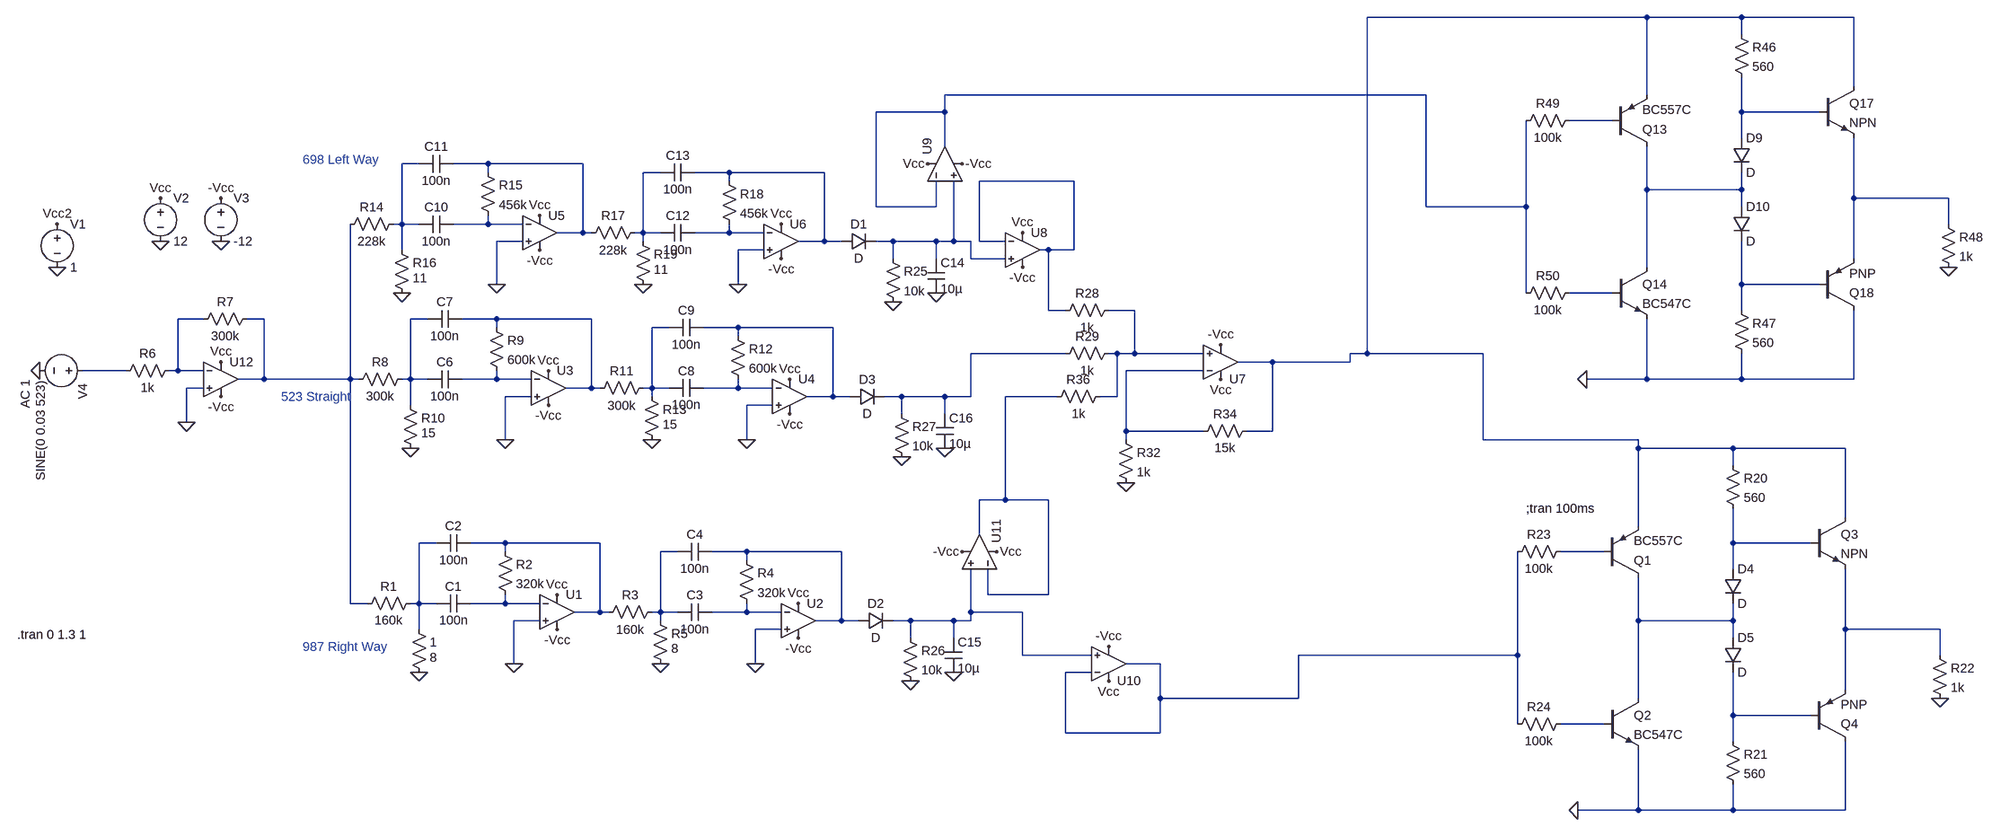
[diagram p0: schematic Might-be-this-one.asc]
Might-be-this-one.asc, the LTspice schematic file:
Version 4
SHEET 1 4472 1424
WIRE 2688 -592 2144 -592
WIRE 2864 -592 2688 -592
WIRE 3072 -592 2864 -592
WIRE 2864 -560 2864 -592
WIRE 3072 -464 3072 -592
WIRE 2256 -448 1360 -448
WIRE 2688 -448 2688 -592
WIRE 1360 -416 1360 -448
WIRE 1360 -416 1232 -416
WIRE 2864 -416 2864 -480
WIRE 3008 -416 2864 -416
WIRE 2624 -400 2544 -400
WIRE 2864 -368 2864 -416
WIRE 1360 -352 1360 -416
WIRE 384 -320 352 -320
WIRE 512 -320 448 -320
WIRE 688 -320 512 -320
WIRE 512 -304 512 -320
WIRE 832 -304 800 -304
WIRE 960 -304 896 -304
WIRE 1136 -304 960 -304
WIRE 960 -288 960 -304
WIRE 1600 -288 1424 -288
WIRE 2688 -272 2688 -352
WIRE 2864 -272 2864 -304
WIRE 2864 -272 2688 -272
WIRE 3072 -256 3072 -368
WIRE 3248 -256 3072 -256
WIRE 800 -240 800 -304
WIRE 1232 -240 1232 -416
WIRE 1344 -240 1344 -288
WIRE 1344 -240 1232 -240
WIRE 2256 -240 2256 -448
WIRE 2464 -240 2464 -400
WIRE 2464 -240 2256 -240
WIRE 2864 -240 2864 -272
WIRE 352 -208 352 -320
WIRE 352 -208 336 -208
WIRE 384 -208 352 -208
WIRE 512 -208 512 -224
WIRE 512 -208 448 -208
WIRE 576 -208 512 -208
WIRE 3248 -208 3248 -256
WIRE 688 -192 688 -320
WIRE 688 -192 640 -192
WIRE 704 -192 688 -192
WIRE 800 -192 800 -240
WIRE 800 -192 784 -192
WIRE 832 -192 800 -192
WIRE 960 -192 960 -208
WIRE 960 -192 896 -192
WIRE 1024 -192 960 -192
WIRE 576 -176 528 -176
WIRE 800 -176 800 -192
WIRE 1136 -176 1136 -304
WIRE 1136 -176 1088 -176
WIRE 1168 -176 1136 -176
WIRE 1264 -176 1232 -176
WIRE 1344 -176 1264 -176
WIRE 1376 -176 1376 -288
WIRE 1376 -176 1344 -176
WIRE 1408 -176 1376 -176
WIRE 1424 -176 1424 -288
WIRE 1472 -176 1424 -176
WIRE 352 -160 352 -208
WIRE 1024 -160 976 -160
WIRE 1552 -160 1536 -160
WIRE 1600 -160 1600 -288
WIRE 1600 -160 1552 -160
WIRE 1264 -144 1264 -176
WIRE 1344 -144 1344 -176
WIRE 1408 -144 1408 -176
WIRE 1472 -144 1408 -144
WIRE 3072 -144 3072 -256
WIRE 2688 -128 2688 -272
WIRE 528 -96 528 -176
WIRE 976 -96 976 -160
WIRE 2864 -96 2864 -176
WIRE 3008 -96 2864 -96
WIRE 2464 -80 2464 -240
WIRE 2624 -80 2544 -80
WIRE 1552 -48 1552 -160
WIRE 1584 -48 1552 -48
WIRE 1712 -48 1664 -48
WIRE 2864 -48 2864 -96
WIRE -16 -32 -64 -32
WIRE 96 -32 64 -32
WIRE 400 -32 368 -32
WIRE 528 -32 464 -32
WIRE 704 -32 528 -32
WIRE 528 -16 528 -32
WIRE 848 -16 816 -16
WIRE 976 -16 912 -16
WIRE 1152 -16 976 -16
WIRE 976 0 976 -16
WIRE 1584 32 1408 32
WIRE 1680 32 1664 32
WIRE 1712 32 1712 -48
WIRE 1712 32 1680 32
WIRE 1840 32 1712 32
WIRE 2144 32 2144 -592
WIRE 2144 32 2112 32
WIRE 2384 32 2144 32
WIRE 1968 48 1904 48
WIRE 2112 48 2112 32
WIRE 2112 48 1968 48
WIRE -160 64 -240 64
WIRE -64 64 -64 -32
WIRE -64 64 -80 64
WIRE -16 64 -64 64
WIRE 1840 64 1696 64
WIRE 96 80 96 -32
WIRE 96 80 48 80
WIRE 256 80 256 -208
WIRE 256 80 96 80
WIRE 272 80 256 80
WIRE 368 80 368 -32
WIRE 368 80 352 80
WIRE 400 80 368 80
WIRE 528 80 528 64
WIRE 528 80 464 80
WIRE 592 80 528 80
WIRE 2688 80 2688 -32
WIRE 2688 80 2576 80
WIRE 2864 80 2864 32
WIRE 2864 80 2688 80
WIRE 3072 80 3072 -48
WIRE 3072 80 2864 80
WIRE -16 96 -48 96
WIRE 704 96 704 -32
WIRE 704 96 656 96
WIRE 720 96 704 96
WIRE 816 96 816 -16
WIRE 816 96 800 96
WIRE 848 96 816 96
WIRE 976 96 976 80
WIRE 976 96 912 96
WIRE 1040 96 976 96
WIRE 592 112 544 112
WIRE 816 112 816 96
WIRE 1152 112 1152 -16
WIRE 1152 112 1104 112
WIRE 1184 112 1152 112
WIRE 1280 112 1248 112
WIRE 1360 112 1280 112
WIRE 1408 112 1408 32
WIRE 1408 112 1360 112
WIRE 1568 112 1472 112
WIRE 1680 112 1680 32
WIRE 1680 112 1648 112
WIRE 368 128 368 80
WIRE 1040 128 992 128
WIRE 1280 144 1280 112
WIRE 1360 144 1360 112
WIRE -48 160 -48 96
WIRE 1696 176 1696 64
WIRE 1840 176 1696 176
WIRE 1968 176 1968 48
WIRE 1968 176 1920 176
WIRE 544 192 544 112
WIRE 992 192 992 128
WIRE 1696 192 1696 176
WIRE 2384 192 2384 32
WIRE 2672 192 2384 192
WIRE 2672 208 2672 192
WIRE 2848 208 2672 208
WIRE 3056 208 2848 208
WIRE 2848 240 2848 208
WIRE 1472 304 1472 112
WIRE 1472 304 1424 304
WIRE 1552 304 1472 304
WIRE 3056 336 3056 208
WIRE 2672 352 2672 208
WIRE 1424 368 1424 304
WIRE 416 384 384 384
WIRE 544 384 480 384
WIRE 720 384 544 384
WIRE 2848 384 2848 320
WIRE 2992 384 2848 384
WIRE 544 400 544 384
WIRE 864 400 832 400
WIRE 992 400 928 400
WIRE 1168 400 992 400
WIRE 2608 400 2528 400
WIRE 992 416 992 400
WIRE 2848 432 2848 384
WIRE 1440 480 1440 432
WIRE 1552 480 1552 304
WIRE 1552 480 1440 480
WIRE 256 496 256 80
WIRE 288 496 256 496
WIRE 384 496 384 384
WIRE 384 496 368 496
WIRE 416 496 384 496
WIRE 544 496 544 480
WIRE 544 496 480 496
WIRE 608 496 544 496
WIRE 720 512 720 384
WIRE 720 512 672 512
WIRE 736 512 720 512
WIRE 832 512 832 400
WIRE 832 512 816 512
WIRE 864 512 832 512
WIRE 992 512 992 496
WIRE 992 512 928 512
WIRE 1056 512 992 512
WIRE 1408 512 1408 432
WIRE 1504 512 1408 512
WIRE 608 528 560 528
WIRE 832 528 832 512
WIRE 1168 528 1168 400
WIRE 1168 528 1120 528
WIRE 1200 528 1168 528
WIRE 1296 528 1264 528
WIRE 1376 528 1296 528
WIRE 1408 528 1408 512
WIRE 1408 528 1376 528
WIRE 2672 528 2672 448
WIRE 2848 528 2848 496
WIRE 2848 528 2672 528
WIRE 384 544 384 496
WIRE 1056 544 1008 544
WIRE 3056 544 3056 432
WIRE 3232 544 3056 544
WIRE 1296 560 1296 528
WIRE 1376 560 1376 528
WIRE 2848 560 2848 528
WIRE 1504 592 1504 512
WIRE 1632 592 1504 592
WIRE 2448 592 2448 400
WIRE 2448 592 2016 592
WIRE 3232 592 3232 544
WIRE 560 608 560 528
WIRE 1008 608 1008 544
WIRE 1760 608 1696 608
WIRE 1632 624 1584 624
WIRE 3056 656 3056 544
WIRE 1760 672 1760 608
WIRE 2016 672 2016 592
WIRE 2016 672 1760 672
WIRE 2672 672 2672 528
WIRE 2848 704 2848 624
WIRE 2992 704 2848 704
WIRE 2448 720 2448 592
WIRE 2608 720 2528 720
WIRE 1584 736 1584 624
WIRE 1760 736 1760 672
WIRE 1760 736 1584 736
WIRE 2848 752 2848 704
WIRE 2672 880 2672 768
WIRE 2672 880 2560 880
WIRE 2848 880 2848 832
WIRE 2848 880 2672 880
WIRE 3056 880 3056 752
WIRE 3056 880 2848 880
FLAG 384 624 0
FLAG -320 64 0
FLAG 640 544 -Vcc
FLAG 560 608 0
FLAG 832 608 0
FLAG 1088 496 Vcc
FLAG 1088 560 -Vcc
FLAG 1008 608 0
FLAG 368 208 0
FLAG 624 64 Vcc
FLAG 624 128 -Vcc
FLAG 544 192 0
FLAG 816 192 0
FLAG 1072 80 Vcc
FLAG 1072 144 -Vcc
FLAG 992 192 0
FLAG 352 -80 0
FLAG 608 -224 Vcc
FLAG 608 -160 -Vcc
FLAG 528 -96 0
FLAG 800 -96 0
FLAG 1056 -208 Vcc
FLAG 1056 -144 -Vcc
FLAG 976 -96 0
FLAG 1280 224 0
FLAG 1360 208 0
FLAG 1376 624 0
FLAG 1296 640 0
FLAG 1264 -64 0
FLAG 1344 -80 0
FLAG -288 -128 0
FLAG -288 -208 Vcc2
FLAG -48 160 0
FLAG 16 112 -Vcc
FLAG 640 480 Vcc
FLAG 16 48 Vcc
FLAG -96 -256 Vcc
FLAG 16 -256 -Vcc
FLAG -96 -176 0
FLAG 16 -176 0
FLAG 3248 -128 0
FLAG 3232 672 0
FLAG 2576 80 0
FLAG 2560 880 0
FLAG 1872 80 Vcc
FLAG 1872 16 -Vcc
FLAG 1328 -320 Vcc
FLAG 1392 -320 -Vcc
FLAG 1664 640 Vcc
FLAG 1664 576 -Vcc
FLAG 1696 272 0
FLAG 1504 -192 Vcc
FLAG 1504 -128 -Vcc
FLAG 1456 400 Vcc
FLAG 1392 400 -Vcc
DATAFLAG 800 -240 "$-V(Vcc)"
SYMBOL res 384 480 R90
WINDOW 0 0 56 VBottom 2
WINDOW 3 32 56 VTop 2
SYMATTR InstName R1
SYMATTR Value 160k
SYMBOL cap 480 480 R90
WINDOW 0 0 32 VBottom 2
WINDOW 3 32 32 VTop 2
SYMATTR InstName C1
SYMATTR Value 100n
SYMBOL cap 480 368 R90
WINDOW 0 0 32 VBottom 2
WINDOW 3 32 32 VTop 2
SYMATTR InstName C2
SYMATTR Value 100n
SYMBOL res 528 384 R0
SYMATTR InstName R2
SYMATTR Value 320k
SYMBOL Opamps\\UniversalOpamp2 640 512 R0
SYMATTR InstName U1
SYMBOL res 368 528 R0
WINDOW 3 36 68 Left 2
SYMATTR Value 8
SYMATTR InstName 1
SYMBOL res 832 496 R90
WINDOW 0 0 56 VBottom 2
WINDOW 3 33 56 VTop 2
SYMATTR InstName R3
SYMATTR Value 160k
SYMBOL cap 928 496 R90
WINDOW 0 0 32 VBottom 2
WINDOW 3 32 32 VTop 2
SYMATTR InstName C3
SYMATTR Value 100n
SYMBOL cap 928 384 R90
WINDOW 0 0 32 VBottom 2
WINDOW 3 32 32 VTop 2
SYMATTR InstName C4
SYMATTR Value 100n
SYMBOL res 976 400 R0
SYMATTR InstName R4
SYMATTR Value 320k
SYMBOL Opamps\\UniversalOpamp2 1088 528 R0
SYMATTR InstName U2
SYMBOL res 816 512 R0
WINDOW 3 36 68 Left 2
SYMATTR Value 8
SYMATTR InstName R5
SYMBOL voltage -224 64 R90
WINDOW 3 17 94 Left 2
WINDOW 123 17 122 Left 2
WINDOW 39 0 0 Left 2
SYMATTR Value SINE(0 0.03 523)
SYMATTR Value2 AC 1
SYMATTR InstName V4
SYMBOL res 368 64 R90
WINDOW 0 0 56 VBottom 2
WINDOW 3 32 56 VTop 2
SYMATTR InstName R8
SYMATTR Value 300k
SYMBOL cap 464 64 R90
WINDOW 0 0 32 VBottom 2
WINDOW 3 32 32 VTop 2
SYMATTR InstName C6
SYMATTR Value 100n
SYMBOL cap 464 -48 R90
WINDOW 0 0 32 VBottom 2
WINDOW 3 32 32 VTop 2
SYMATTR InstName C7
SYMATTR Value 100n
SYMBOL res 512 -32 R0
SYMATTR InstName R9
SYMATTR Value 600k
SYMBOL Opamps\\UniversalOpamp2 624 96 R0
SYMATTR InstName U3
SYMBOL res 352 112 R0
WINDOW 3 36 68 Left 2
SYMATTR Value 15
SYMATTR InstName R10
SYMBOL res 816 80 R90
WINDOW 0 0 56 VBottom 2
WINDOW 3 33 56 VTop 2
SYMATTR InstName R11
SYMATTR Value 300k
SYMBOL cap 912 80 R90
WINDOW 0 0 32 VBottom 2
WINDOW 3 32 32 VTop 2
SYMATTR InstName C8
SYMATTR Value 100n
SYMBOL cap 912 -32 R90
WINDOW 0 0 32 VBottom 2
WINDOW 3 32 32 VTop 2
SYMATTR InstName C9
SYMATTR Value 100n
SYMBOL res 960 -16 R0
SYMATTR InstName R12
SYMATTR Value 600k
SYMBOL Opamps\\UniversalOpamp2 1072 112 R0
SYMATTR InstName U4
SYMBOL res 800 96 R0
WINDOW 3 36 68 Left 2
SYMATTR Value 15
SYMATTR InstName R13
SYMBOL res 352 -224 R90
WINDOW 0 0 56 VBottom 2
WINDOW 3 32 56 VTop 2
SYMATTR InstName R14
SYMATTR Value 228k
SYMBOL cap 448 -224 R90
WINDOW 0 0 32 VBottom 2
WINDOW 3 32 32 VTop 2
SYMATTR InstName C10
SYMATTR Value 100n
SYMBOL cap 448 -336 R90
WINDOW 0 0 32 VBottom 2
WINDOW 3 32 32 VTop 2
SYMATTR InstName C11
SYMATTR Value 100n
SYMBOL res 496 -320 R0
SYMATTR InstName R15
SYMATTR Value 456k
SYMBOL Opamps\\UniversalOpamp2 608 -192 R0
SYMATTR InstName U5
SYMBOL res 336 -176 R0
WINDOW 3 36 68 Left 2
SYMATTR Value 11
SYMATTR InstName R16
SYMBOL res 800 -208 R90
WINDOW 0 0 56 VBottom 2
WINDOW 3 33 56 VTop 2
SYMATTR InstName R17
SYMATTR Value 228k
SYMBOL cap 896 -208 R90
WINDOW 0 0 32 VBottom 2
WINDOW 3 32 32 VTop 2
SYMATTR InstName C12
SYMATTR Value 100n
SYMBOL cap 896 -320 R90
WINDOW 0 0 32 VBottom 2
WINDOW 3 32 32 VTop 2
SYMATTR InstName C13
SYMATTR Value 100n
SYMBOL res 944 -304 R0
SYMATTR InstName R18
SYMATTR Value 456k
SYMBOL Opamps\\UniversalOpamp2 1056 -176 R0
SYMATTR InstName U6
SYMBOL res 784 -192 R0
WINDOW 3 36 68 Left 2
SYMATTR Value 11
SYMATTR InstName R19
SYMBOL diode 1168 -160 R270
WINDOW 0 32 32 VTop 2
WINDOW 3 0 32 VBottom 2
SYMATTR InstName D1
SYMBOL diode 1200 544 R270
WINDOW 0 32 32 VTop 2
WINDOW 3 0 32 VBottom 2
SYMATTR InstName D2
SYMBOL diode 1184 128 R270
WINDOW 0 32 32 VTop 2
WINDOW 3 0 32 VBottom 2
SYMATTR InstName D3
SYMBOL res 1248 -160 R0
SYMATTR InstName R25
SYMATTR Value 10k
SYMBOL res 1280 544 R0
SYMATTR InstName R26
SYMATTR Value 10k
SYMBOL res 1264 128 R0
SYMATTR InstName R27
SYMATTR Value 10k
SYMBOL cap 1328 -144 R0
SYMATTR InstName C14
SYMATTR Value 10µ
SYMBOL cap 1360 560 R0
SYMATTR InstName C15
SYMATTR Value 10µ
SYMBOL cap 1344 144 R0
SYMATTR InstName C16
SYMATTR Value 10µ
SYMBOL voltage -288 -224 R0
WINDOW 123 0 0 Left 2
WINDOW 39 0 0 Left 2
SYMATTR InstName V1
SYMATTR Value 1
SYMBOL Opamps\\UniversalOpamp2 16 80 R0
SYMATTR InstName U12
SYMBOL res -64 48 R90
WINDOW 0 0 56 VBottom 2
WINDOW 3 32 56 VTop 2
SYMATTR InstName R6
SYMATTR Value 1k
SYMBOL res 80 -48 R90
WINDOW 0 0 56 VBottom 2
WINDOW 3 32 56 VTop 2
SYMATTR InstName R7
SYMATTR Value 300k
SYMBOL voltage -96 -272 R0
WINDOW 123 0 0 Left 2
WINDOW 39 0 0 Left 2
SYMATTR InstName V2
SYMATTR Value 12
SYMBOL voltage 16 -272 R0
WINDOW 123 0 0 Left 2
WINDOW 39 0 0 Left 2
SYMATTR InstName V3
SYMATTR Value -12
SYMBOL pnp 2624 -352 M180
SYMATTR InstName Q13
SYMATTR Value BC557C
SYMBOL npn 2624 -128 R0
SYMATTR InstName Q14
SYMATTR Value BC547C
SYMBOL npn 3008 -464 R0
SYMATTR InstName Q17
SYMBOL pnp 3008 -48 M180
SYMATTR InstName Q18
SYMBOL res 2848 -576 R0
SYMATTR InstName R46
SYMATTR Value 560
SYMBOL res 2848 -64 R0
SYMATTR InstName R47
SYMATTR Value 560
SYMBOL diode 2848 -368 R0
SYMATTR InstName D9
SYMBOL diode 2848 -240 R0
SYMATTR InstName D10
SYMBOL res 3232 -224 R0
SYMATTR InstName R48
SYMATTR Value 1k
SYMBOL res 2560 -416 R90
WINDOW 0 0 56 VBottom 2
WINDOW 3 32 56 VTop 2
SYMATTR InstName R49
SYMATTR Value 100k
SYMBOL res 2560 -96 R90
WINDOW 0 0 56 VBottom 2
WINDOW 3 32 56 VTop 2
SYMATTR InstName R50
SYMATTR Value 100k
SYMBOL pnp 2608 448 M180
SYMATTR InstName Q1
SYMATTR Value BC557C
SYMBOL npn 2608 672 R0
SYMATTR InstName Q2
SYMATTR Value BC547C
SYMBOL npn 2992 336 R0
SYMATTR InstName Q3
SYMBOL pnp 2992 752 M180
SYMATTR InstName Q4
SYMBOL res 2832 224 R0
SYMATTR InstName R20
SYMATTR Value 560
SYMBOL res 2832 736 R0
SYMATTR InstName R21
SYMATTR Value 560
SYMBOL diode 2832 432 R0
SYMATTR InstName D4
SYMBOL diode 2832 560 R0
SYMATTR InstName D5
SYMBOL res 3216 576 R0
SYMATTR InstName R22
SYMATTR Value 1k
SYMBOL res 2544 384 R90
WINDOW 0 0 56 VBottom 2
WINDOW 3 32 56 VTop 2
SYMATTR InstName R23
SYMATTR Value 100k
SYMBOL res 2544 704 R90
WINDOW 0 0 56 VBottom 2
WINDOW 3 32 56 VTop 2
SYMATTR InstName R24
SYMATTR Value 100k
SYMBOL Opamps\\UniversalOpamp2 1872 48 M180
SYMATTR InstName U7
SYMBOL res 1680 -64 R90
WINDOW 0 0 56 VBottom 2
WINDOW 3 32 56 VTop 2
SYMATTR InstName R28
SYMATTR Value 1k
SYMBOL res 1680 16 R90
WINDOW 0 0 56 VBottom 2
WINDOW 3 32 56 VTop 2
SYMATTR InstName R29
SYMATTR Value 1k
SYMBOL Opamps\\UniversalOpamp2 1360 -320 R270
SYMATTR InstName U9
SYMBOL Opamps\\UniversalOpamp2 1664 608 M180
SYMATTR InstName U10
SYMBOL res 1680 176 R0
SYMATTR InstName R32
SYMATTR Value 1k
SYMBOL res 1936 160 R90
WINDOW 0 0 56 VBottom 2
WINDOW 3 32 56 VTop 2
SYMATTR InstName R34
SYMATTR Value 15k
SYMBOL res 1664 96 R90
WINDOW 0 0 56 VBottom 2
WINDOW 3 32 56 VTop 2
SYMATTR InstName R36
SYMATTR Value 1k
SYMBOL Opamps\\UniversalOpamp2 1504 -160 R0
SYMATTR InstName U8
SYMBOL Opamps\\UniversalOpamp2 1424 400 M270
SYMATTR InstName U11
TEXT 168 -328 Left 2 ;698 Left Way
TEXT 128 112 Left 2 ;523 Straight
TEXT 168 576 Left 2 ;987 Right Way
TEXT -362 554 Left 2 !.tran 0 1.3 1
TEXT 2464 320 Left 2 !;tran 100ms

The netlist it stands for:
* Might-be-this-one.asc
R1 N030 N019 160k
C1 N036 N030 100n
C2 N031 N030 100n
R2 N031 N036 320k
XU1 0 N036 Vcc -Vcc N031 level.2 Avol=1Meg GBW=10Meg Slew=10Meg ilimit=25m rail=0 Vos=0 phimargin=45 en=0 enk=0 in=0 ink=0 Rin=500Meg  ; pins IN+ IN- V+ V- OUT
R§1 N030 0 8
R3 N033 N031 160k
C3 N037 N033 100n
C4 N034 N033 100n
R4 N034 N037 320k
XU2 0 N037 Vcc -Vcc N034 level.2 Avol=1Meg GBW=10Meg Slew=10Meg ilimit=25m rail=0 Vos=0 phimargin=45 en=0 enk=0 in=0 ink=0 Rin=500Meg  ; pins IN+ IN- V+ V- OUT
R5 N033 0 8
V4 N025 0 SINE(0 0.03 523) AC 1
R8 N020 N019 300k
C6 N027 N020 100n
C7 N021 N020 100n
R9 N021 N027 600k
XU3 0 N027 Vcc -Vcc N021 level.2 Avol=1Meg GBW=10Meg Slew=10Meg ilimit=25m rail=0 Vos=0 phimargin=45 en=0 enk=0 in=0 ink=0 Rin=500Meg  ; pins IN+ IN- V+ V- OUT
R10 N020 0 15
R11 N022 N021 300k
C8 N028 N022 100n
C9 N023 N022 100n
R12 N023 N028 600k
XU4 0 N028 Vcc -Vcc N023 level.2 Avol=1Meg GBW=10Meg Slew=10Meg ilimit=25m rail=0 Vos=0 phimargin=45 en=0 enk=0 in=0 ink=0 Rin=500Meg  ; pins IN+ IN- V+ V- OUT
R13 N022 0 15
R14 N005 N019 228k
C10 N012 N005 100n
C11 N006 N005 100n
R15 N006 N012 456k
XU5 0 N012 Vcc -Vcc N006 level.2 Avol=1Meg GBW=10Meg Slew=10Meg ilimit=25m rail=0 Vos=0 phimargin=45 en=0 enk=0 in=0 ink=0 Rin=500Meg  ; pins IN+ IN- V+ V- OUT
R16 N005 0 11
R17 N007 N006 228k
C12 N013 N007 100n
C13 N008 N007 100n
R18 N008 N013 456k
XU6 0 N013 Vcc -Vcc N008 level.2 Avol=1Meg GBW=10Meg Slew=10Meg ilimit=25m rail=0 Vos=0 phimargin=45 en=0 enk=0 in=0 ink=0 Rin=500Meg  ; pins IN+ IN- V+ V- OUT
R19 N007 0 11
D1 N008 N014 D
D2 N034 N038 D
D3 N023 N024 D
R25 N014 0 10k
R26 N038 0 10k
R27 N024 0 10k
C14 N014 0 10µ
C15 N038 0 10µ
C16 N024 0 10µ
V1 Vcc2 0 1
XU12 0 N018 Vcc -Vcc N019 level.2 Avol=1Meg GBW=10Meg Slew=10Meg ilimit=25m rail=0 Vos=0 phimargin=45 en=0 enk=0 in=0 ink=0 Rin=500Meg  ; pins IN+ IN- V+ V- OUT
R6 N018 N025 1k
R7 N019 N018 300k
V2 Vcc 0 12
V3 -Vcc 0 -12
Q13 N010 N004 N001 0 BC557C
Q14 N010 N016 0 0 BC547C
Q17 N001 N003 N011 0 NPN
Q18 0 N015 N011 0 PNP
R46 N001 N003 560
R47 N015 0 560
D9 N003 N010 D
D10 N010 N015 D
R48 N011 0 1k
R49 N004 N002 100k
R50 N016 N002 100k
Q1 N039 N035 N001 0 BC557C
Q2 N039 N043 0 0 BC547C
Q3 N001 N032 N040 0 NPN
Q4 0 N042 N040 0 PNP
R20 N001 N032 560
R21 N042 0 560
D4 N032 N039 D
D5 N039 N042 D
R22 N040 0 1k
R23 N035 N041 100k
R24 N043 N041 100k
XU7 N017 N026 Vcc -Vcc N001 level.2 Avol=1Meg GBW=10Meg Slew=10Meg ilimit=25m rail=0 Vos=0 phimargin=45 en=0 enk=0 in=0 ink=0 Rin=500Meg  ; pins IN+ IN- V+ V- OUT
R28 N017 N009 1k
R29 N017 N024 1k
XU9 N014 N002 Vcc -Vcc N002 level.2 Avol=1Meg GBW=10Meg Slew=10Meg ilimit=25m rail=0 Vos=0 phimargin=45 en=0 enk=0 in=0 ink=0 Rin=500Meg  ; pins IN+ IN- V+ V- OUT
XU10 N038 N041 Vcc -Vcc N041 level.2 Avol=1Meg GBW=10Meg Slew=10Meg ilimit=25m rail=0 Vos=0 phimargin=45 en=0 enk=0 in=0 ink=0 Rin=500Meg  ; pins IN+ IN- V+ V- OUT
R32 N026 0 1k
R34 N001 N026 15k
R36 N017 N029 1k
XU8 N014 N009 Vcc -Vcc N009 level.2 Avol=1Meg GBW=10Meg Slew=10Meg ilimit=25m rail=0 Vos=0 phimargin=45 en=0 enk=0 in=0 ink=0 Rin=500Meg  ; pins IN+ IN- V+ V- OUT
XU11 N038 N029 Vcc -Vcc N029 level.2 Avol=1Meg GBW=10Meg Slew=10Meg ilimit=25m rail=0 Vos=0 phimargin=45 en=0 enk=0 in=0 ink=0 Rin=500Meg  ; pins IN+ IN- V+ V- OUT
.model D D
.lib standard.dio
.model NPN NPN
.model PNP PNP
.lib standard.bjt
* 698 Left Way
* 523 Straight
* 987 Right Way
.tran 0 1.3 1
;tran 100ms
.lib UniversalOpamps2.sub
.backanno
.end